# EAGLE schematic DCO DIL14 (EAGLE 6.5.0)
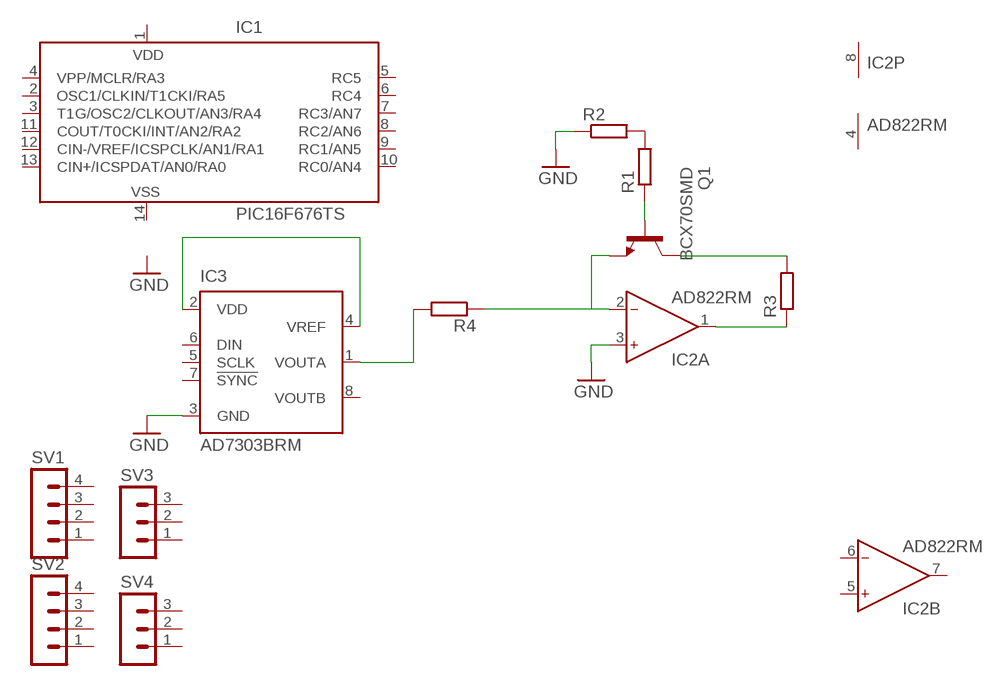
[diagram p0: schematic, sheet 1]

## Parts
IC1  PIC16F676TS  [TSSOP14]
IC2  AD822RM  [MSOP08]
IC3  AD7303BRM  [MSOP08]
Q1  BCX70SMD  [SOT23]
R1  R-EU_R0603  [R0603]
R2  R-EU_R0603  [R0603]
R3  R-EU_R0603  [R0603]
R4  R-EU_R0603  [R0603]
SV1  MA04-1J  [MA04-1J]
SV2  MA04-1J  [MA04-1J]
SV3  MA03-1J  [MA03-1J]
SV4  MA03-1J  [MA03-1J]

## Nets
GND: IC2.3(A:IN+) IC3.3(GND) R2.1
N$1: R1.2 R2.2
N$2: IC2.1(A:OUT) R3.1
N$3: IC2.2(A:IN-) Q1.2(E) R4.1
N$4: IC3.1(VOUTA) R4.2
N$5: IC3.2(VDD) IC3.4(VREF)
N$6: Q1.3(C) R3.2
N$7: Q1.1(B) R1.1
Unconnected: IC1.2(OSC1/CLKIN/T1CKI/RA5) IC1.3(T1G/OSC2/CLKOUT/AN3/RA4) IC1.4(VPP/MCLR/RA3) IC1.5(RC5) IC1.6(RC4) IC1.7(RC3/AN7) IC1.8(RC2/AN6) IC1.9(RC1/AN5) IC1.10(RC0/AN4) IC1.11(COUT/T0CKI/INT/AN2/RA2) IC1.12(CIN-/VREF/ICSPCLK/AN1/RA1) IC1.13(CIN+/ICSPDAT/AN0/RA0) IC2.5(B:IN+) IC2.6(B:IN-) IC2.7(B:OUT) IC3.5(SCLK) IC3.6(DIN) IC3.7(!SYNC) IC3.8(VOUTB) SV1.1 SV1.2 SV1.3 SV1.4 SV2.1 SV2.2 SV2.3 SV2.4 SV3.1 SV3.2 SV3.3 SV4.1 SV4.2 SV4.3

## Power pins joined to a net without a drawn wire
V+: IC2.8(P:V+)
V-: IC2.4(P:V-)
VDD: IC1.1(VDD)
VSS: IC1.14(VSS)

## Library data of the parts
IC1 = microchip:PIC16F676: 14-Pin, Flash-Based 8-Bit CMOS Microcontroller High Performance RISC CPU: * Only 35 instructions to learn - All single-cycle instructions except branches * Operating speed: - DC - 20 MHz oscillator/clock input - DC - 200 ns instruction cycle * Internal and external oscillator options - Precision Internal 4 MHz oscillator factory calibrated to ±1% - External Oscillator support for crystals and resonators - 5?s wake-up from SLEEP, 3.0V, typical * Power saving SLEEP mode * Wide operating voltage range - 2.0V to 5.5V * Industrial and Extended temperature range * Low power Power-on Reset (POR) * Power-up Timer (PWRT) and Oscillator Start-up Timer (OST) * Brown-out Detect (BOD) * Watchdog Timer (WDT) with independent oscillator for reliable operation * Multiplexed MCLR/Input-pin * Interrupt-on-pin change * Individual programmable weak pull-ups * Programmable code protection * High Endurance FLASH/EEPROM Cell - 100,000 write FLASH endurance - 1,000,000 write EEPROM endurance - FLASH/Data EEPROM Retention: > 40 years * Standby Current: - 1 nA @ 2.0V, typical * Operating Current: - 8.5?A @ 32 kHz, 2.0V, typical - 100?A @ 1 MHz, 2.0V, typical * Watchdog Timer Current - 300 nA @ 2.0V, typical * Timer1 oscillator current: - 4?A @ 32 kHz, 2.0V, typical * 12 I/O pins with individual direction control * High current sink/source for direct LED drive * Analog-to-Digital Converter module (PIC16F676): - 10-bit resolution - Programmable 8-channel input - Voltage reference input * In-Circuit Serial ProgrammingTM (ICSPTM) via two pins Source: http://ww1.microchip.com/downloads/en/DeviceDoc/40039E.pdf; MF: MICROCHIP; MPN: PIC16F676-E/ST; OC_FARNELL: 9760539; OC_NEWARK: 92C4552
IC2 = analog-devices:AD822: Single-Supply, Rail-to-Rail Low Power FET-Input Op Amp Source: http://www.analog.com/static/imported-files/data_sheets/AD822.pdf; MPN: AD822ARMZ-R2; OC_FARNELL: 1827360; OC_NEWARK: 19M8890
IC3 = analog-devices:AD7303B: +2.7 V to +5.5 V, Serial Input, Dual Voltage Output 8-Bit DAC Source: http://www.analog.com/UploadedFiles/Data_Sheets/AD7303.pdf; MF: ALTERA CORPORATION; MPN: AD7303BRMZ; OC_FARNELL: 1464525; OC_NEWARK: 59K4694
Q1 = transistor-npn:BCX70*: NPN Transistor
R1-R4 = resistor:R-EU_: RESISTOR, European symbol
SV1 SV2 = joakim:MA04-1J: PIN HEADER; OC_FARNELL: unknown; OC_NEWARK: unknown
SV3 SV4 = joakim:MA03-1J: PIN HEADER; OC_FARNELL: unknown; OC_NEWARK: unknown